# Altium schematic sheet Vector_Mini_ST_2.SchDoc
size 355 x 193 mm; SheetNumber: 2; SheetTotal: 2
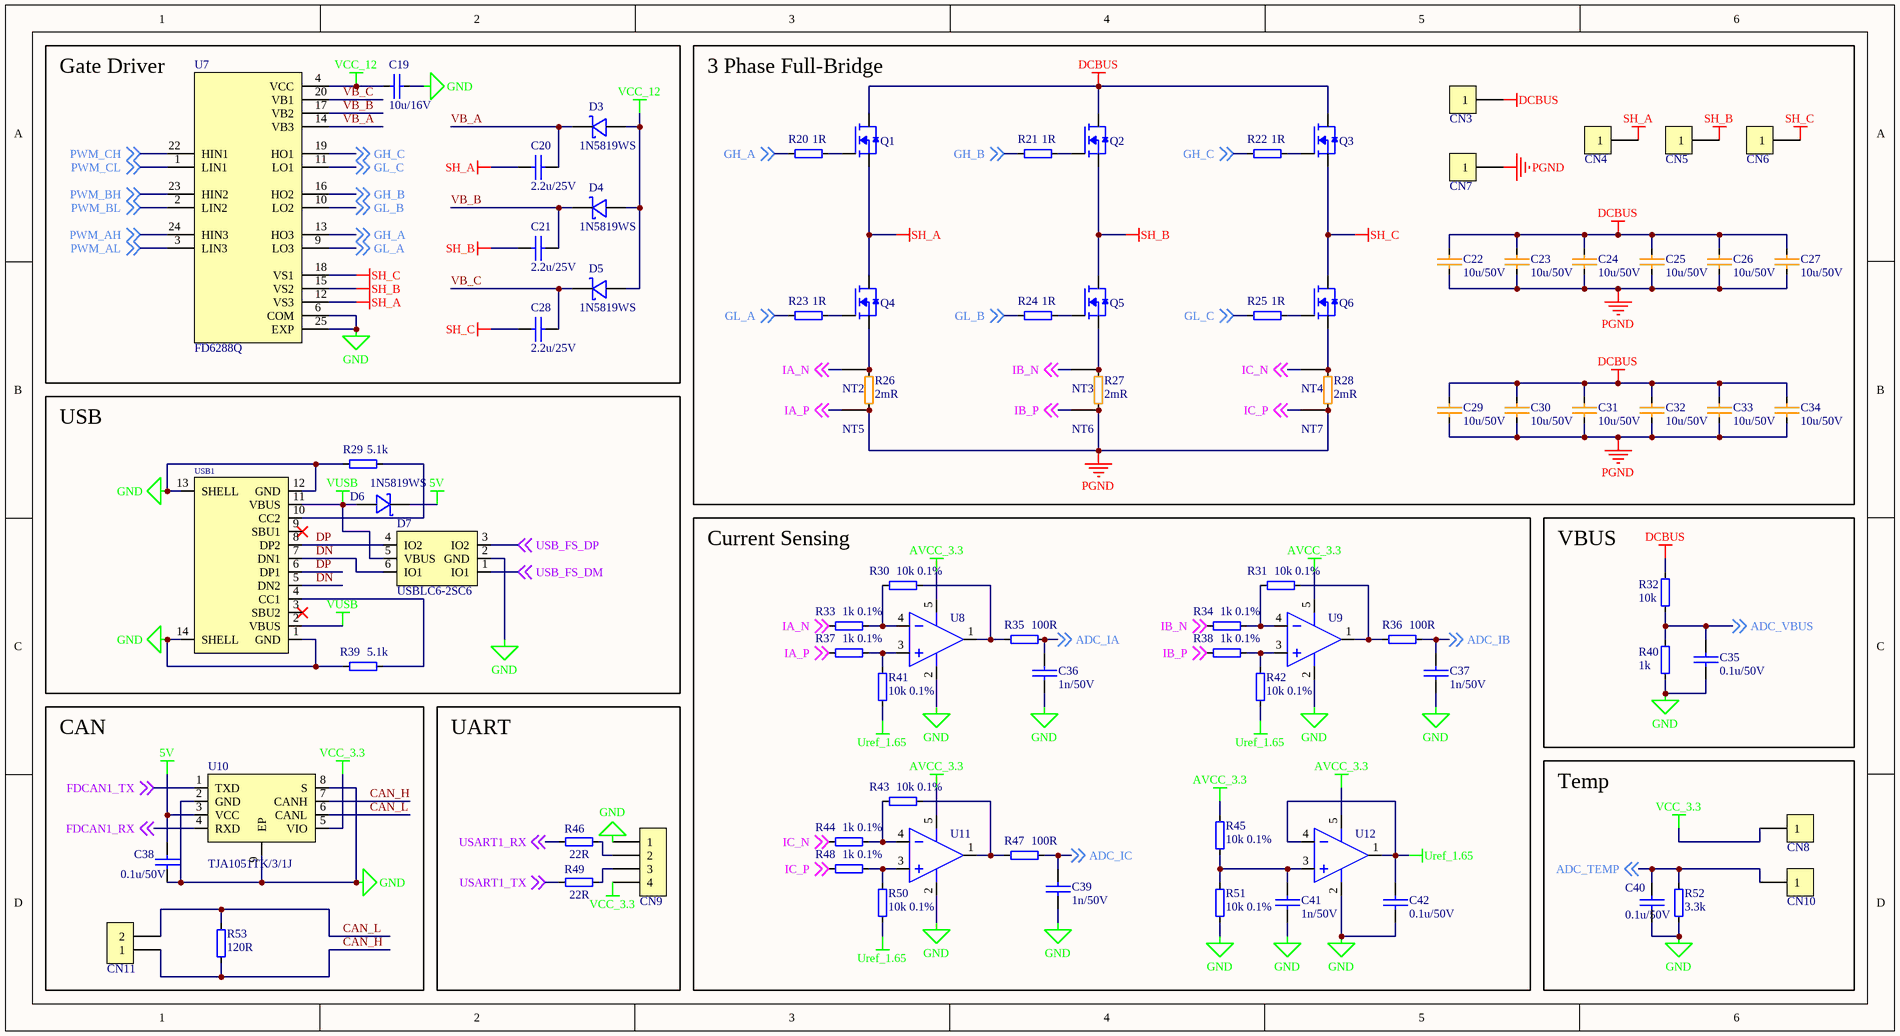
[diagram p0: Vector_Mini_ST_2.SchDoc]

## Parts
C19  10u/16V  [C0603_S]
C20  2.2u/25V  [C0603_S]
C21  2.2u/25V  [C0603_S]
C22  10u/50V  [C1206_S]
C23  10u/50V  [C1206_S]
C24  10u/50V  [C1206_S]
C25  10u/50V  [C1206_S]
C26  10u/50V  [C1206_S]
C27  10u/50V  [C1206_S]
C28  2.2u/25V  [C0603_S]
C29  10u/50V  [C1206_S]
C30  10u/50V  [C1206_S]
C31  10u/50V  [C1206_S]
C32  10u/50V  [C1206_S]
C33  10u/50V  [C1206_S]
C34  10u/50V  [C1206_S]
C35  0.1u/50V  [C0603_S]
C36  1n/50V  [C0603_S]
C37  1n/50V  [C0603_S]
C38  0.1u/50V  [C0603_S]
C39  1n/50V  [C0603_S]
C40  0.1u/50V  [C0603_S]
C41  1n/50V  [C0603_S]
C42  0.1u/50V  [C0603_S]
CN3  PAD 5*4  [PAD 5*4]  (value not drawn)
CN4  PAD 5*4  [PAD 5*4]  (value not drawn)
CN5  PAD 5*4  [PAD 5*4]  (value not drawn)
CN6  PAD 5*4  [PAD 5*4]  (value not drawn)
CN7  PAD 5*4  [PAD 5*4]  (value not drawn)
CN8  PAD 1*1  [PAD 1*1]  (value not drawn)
CN9  GH1.25-4P  [GH1.25-WS-4P]  (value not drawn)
CN10  PAD 1*1  [PAD 1*1]  (value not drawn)
CN11  GH1.25-2P  [GH1.25-WS-2P]  (value not drawn)
D3  1N5819WS  [SOD-323]
D4  1N5819WS  [SOD-323]
D5  1N5819WS  [SOD-323]
D6  1N5819WS  [SOD-323]
D7  USBLC6-2SC6  [SOT-23-6]
NT2  NetTie_6mil  [Nettie6mil]  (value not drawn)  (net tie, no BOM)
NT3  NetTie_6mil  [Nettie6mil]  (value not drawn)  (net tie, no BOM)
NT4  NetTie_6mil  [Nettie6mil]  (value not drawn)  (net tie, no BOM)
NT5  NetTie_6mil  [Nettie6mil]  (value not drawn)  (net tie, no BOM)
NT6  NetTie_6mil  [Nettie6mil]  (value not drawn)  (net tie, no BOM)
NT7  NetTie_6mil  [Nettie6mil]  (value not drawn)  (net tie, no BOM)
Q1  CSD18540Q5B  [VSON-8]  (value not drawn)
Q2  CSD18540Q5B  [VSON-8]  (value not drawn)
Q3  CSD18540Q5B  [VSON-8]  (value not drawn)
Q4  CSD18540Q5B  [VSON-8]  (value not drawn)
Q5  CSD18540Q5B  [VSON-8]  (value not drawn)
Q6  CSD18540Q5B  [VSON-8]  (value not drawn)
R20  1R  [R0603_S]
R21  1R  [R0603_S]
R22  1R  [R0603_S]
R23  1R  [R0603_S]
R24  1R  [R0603_S]
R25  1R  [R0603_S]
R26  2mR  [R2512_S]
R27  2mR  [R2512_S]
R28  2mR  [R2512_S]
R29  5.1k  [R0603_S]
R30  10k 0.1%  [R0603_S]
R31  10k 0.1%  [R0603_S]
R32  10k  [R0603_S]
R33  1k 0.1%  [R0603_S]
R34  1k 0.1%  [R0603_S]
R35  100R  [R0603_S]
R36  100R  [R0603_S]
R37  1k 0.1%  [R0603_S]
R38  1k 0.1%  [R0603_S]
R39  5.1k  [R0603_S]
R40  1k  [R0603_S]
R41  10k 0.1%  [R0603_S]
R42  10k 0.1%  [R0603_S]
R43  10k 0.1%  [R0603_S]
R44  1k 0.1%  [R0603_S]
R45  10k 0.1%  [R0603_S]
R46  22R  [R0603_S]
R47  100R  [R0603_S]
R48  1k 0.1%  [R0603_S]
R49  22R  [R0603_S]
R50  10k 0.1%  [R0603_S]
R51  10k 0.1%  [R0603_S]
R52  3.3k  [R0603_S]
R53  120R  [R0603_S]
U7  FD6288Q  [QFN-24]
U8  RS721XF  [SOT-23-5]  (value not drawn)
U9  RS721XF  [SOT-23-5]  (value not drawn)
U10  TJA1051TK/3/1J  [VDFN-8]
U11  RS721XF  [SOT-23-5]  (value not drawn)
U12  RS721XF  [SOT-23-5]  (value not drawn)
USB1  TYPEC-WS-16P  [TYPEC-WS-16P]  (value not drawn)

## Blocks framed on the sheet
Gate Driver: C19-C21 C28 D3-D5 U7
3 Phase Full-Bridge: C22-C27 C29-C34 CN3-CN7 NT2-NT7 Q1-Q6 R20-R28
USB: D6 D7 R29 R39 USB1
Current Sensing: C36 C37 C39 C41 C42 R30 R31 R33-R38 R41-R45 R47 R48 R50 R51 U8 U9 U11 U12
VBUS: C35 R32 R40
CAN: C38 CN11 R53 U10
UART: CN9 R46 R49
Temp: C40 CN8 CN10 R52

## Nets
5V: C38.1 D6.1(K) U10.3(VCC)
AVCC_3.3: R45.2 U8.5(V+) U9.5(V+) U11.5(V+) U12.5(V+)
DCBUS: C22.1 C23.1 C24.1 C25.1 C26.1 C27.1 C29.1 C30.1 C31.1 C32.1 C33.1 C34.1 CN3.1 Q1.3(D) Q2.3(D) Q3.3(D) R32.2
GND: C19.2 C35.1 C36.1 C37.1 C38.2 C39.1 C40.2 C41.1 C42.1 CN9.1 D7.2(GND) R29.1 R39.1 R40.1 R51.1 R52.1 U7.6(COM) U7.25(EXP) U8.2(V-) U9.2(V-) U10.2(GND) U10.8(S) U10.9(EP) U11.2(V-) U12.2(V-) USB1.1(GND) USB1.12(GND) USB1.13(SHELL) USB1.14(SHELL)
PGND: C22.2 C23.2 C24.2 C25.2 C26.2 C27.2 C29.2 C30.2 C31.2 C32.2 C33.2 C34.2 CN7.1 NT5.2 NT6.2 NT7.2 R26.1 R27.1 R28.1
SH_A: C20.1 CN4.1 Q1.1(S) Q4.3(D) U7.12(VS3)
SH_B: C21.1 CN5.1 Q2.1(S) Q5.3(D) U7.15(VS2)
SH_C: C28.1 CN6.1 Q3.1(S) Q6.3(D) U7.18(VS1)
Uref_1.65: C42.2 R41.1 R42.1 R50.1 U12.1(OUT) U12.4(-IN)
VCC_3.3: CN8.1 CN9.4 U10.5(VIO)
VCC_12: C19.1 D3.2(A) D4.2(A) D5.2(A) U7.4(VCC)
VUSB: D6.2(A) D7.5(VBUS) USB1.2(VBUS) USB1.11(VBUS)
ADC_IA: C36.2 R35.2 ; off-sheet ADC_IA
ADC_IB: C37.2 R36.2 ; off-sheet ADC_IB
ADC_IC: C39.2 R47.2 ; off-sheet ADC_IC
ADC_TEMP: C40.1 CN10.1 R52.2 ; off-sheet ADC_TEMP
ADC_VBUS: C35.2 R32.1 R40.2 ; off-sheet ADC_VBUS
CAN_H: CN11.1 R53.1 U10.7(CANH)
CAN_L: CN11.2 R53.2 U10.6(CANL)
DN: D7.6(IO1) USB1.5(DN2) USB1.7(DN1)
DP: D7.4(IO2) USB1.6(DP1) USB1.8(DP2)
FDCAN1_RX: U10.4(RXD) ; off-sheet FDCAN1_RX
FDCAN1_TX: U10.1(TXD) ; off-sheet FDCAN1_TX
GH_A: R20.1 U7.13(HO3) ; off-sheet GH_A
GH_B: R21.1 U7.16(HO2) ; off-sheet GH_B
GH_C: R22.1 U7.19(HO1) ; off-sheet GH_C
GL_A: R23.1 U7.9(LO3) ; off-sheet GL_A
GL_B: R24.1 U7.10(LO2) ; off-sheet GL_B
GL_C: R25.1 U7.11(LO1) ; off-sheet GL_C
IA_N: NT2.1 R33.1 ; off-sheet IA_N
IA_P: NT5.1 R37.1 ; off-sheet IA_P
IB_N: NT3.1 R34.1 ; off-sheet IB_N
IB_P: NT6.1 R38.1 ; off-sheet IB_P
IC_N: NT4.1 R44.1 ; off-sheet IC_N
IC_P: NT7.1 R48.1 ; off-sheet IC_P
PWM_AH: U7.24(HIN3) ; off-sheet PWM_AH
PWM_AL: U7.3(LIN3) ; off-sheet PWM_AL
PWM_BH: U7.23(HIN2) ; off-sheet PWM_BH
PWM_BL: U7.2(LIN2) ; off-sheet PWM_BL
PWM_CH: U7.22(HIN1) ; off-sheet PWM_CH
PWM_CL: U7.1(LIN1) ; off-sheet PWM_CL
USART1_RX: R46.1 ; off-sheet USART1_RX
USART1_TX: R49.1 ; off-sheet USART1_TX
USB_FS_DM: D7.1(IO1) ; off-sheet USB_FS_DM
USB_FS_DP: D7.3(IO2) ; off-sheet USB_FS_DP
VB_A: C20.2 D3.1(K) U7.14(VB3)
VB_B: C21.2 D4.1(K) U7.17(VB2)
VB_C: C28.2 D5.1(K) U7.20(VB1)
NetC41_2: C41.2 R45.1 R51.2 U12.3(+IN)
NetCN9_2: CN9.2 R46.2
NetCN9_3: CN9.3 R49.2
NetNT2_2: NT2.2 Q4.1(S) R26.2
NetNT3_2: NT3.2 Q5.1(S) R27.2
NetNT4_2: NT4.2 Q6.1(S) R28.2
NetQ1_2: Q1.2(G) R20.2
NetQ2_2: Q2.2(G) R21.2
NetQ3_2: Q3.2(G) R22.2
NetQ4_2: Q4.2(G) R23.2
NetQ5_2: Q5.2(G) R24.2
NetQ6_2: Q6.2(G) R25.2
NetR29_2: R29.2 USB1.10(CC2)
NetR30_1: R30.1 R33.2 U8.4(-IN)
NetR30_2: R30.2 R35.1 U8.1(OUT)
NetR31_1: R31.1 R34.2 U9.4(-IN)
NetR31_2: R31.2 R36.1 U9.1(OUT)
NetR37_2: R37.2 R41.2 U8.3(+IN)
NetR38_2: R38.2 R42.2 U9.3(+IN)
NetR39_2: R39.2 USB1.4(CC1)
NetR43_1: R43.1 R44.2 U11.4(-IN)
NetR43_2: R43.2 R47.1 U11.1(OUT)
NetR48_2: R48.2 R50.2 U11.3(+IN)

Not connected (* = marked no-connect by the designer): USB1 3(SBU2)* 9(SBU1)*

## Library data of the parts
C19-C21 C28 C35-C42 = CAP: 贴片电容
C22-C27 C29-C34 = C1206: 1206贴片电容
D3-D6 = 1N5819WS: 肖特基二极管; Manufacturer: Hottech(合科泰); Device: 1N5819WS_C191023; Add into BOM: yes; Forward Voltage (Vf@If): 600mV@1A; Reverse Voltage (Vr): 40V; Average Rectified Current (Io): 1A; Symbol: 1N5819WS; Supplier: LCSC; Supplier Part: C191023; Manufacturer Part: 1N5819WS; JLCPCB Part Class: 基础库; LCSC Part Name: 电压:40V 电流:1A; Supplier Footprint: SOD-323; Datasheet: https://atta.szlcsc.com/upload/public/pdf/source/20220428/3CB86FD8D28D653594B4E35F9D5AEFD9.pdf; Convert to PCB: yes
D7 = USBLC6-2SC6: USB 2.0高速接口的ESD保护
Q1-Q6 = CSD18540Q5B: MF: Texas Instruments; SnapEDA_Link: https://www.snapeda.com/parts/CSD18540Q5B/Texas+Instruments/view-part/?ref=snap; Package: VSON-CLIP-8 Texas Instruments; Value: *; MP: CSD18540Q5B; Check_prices: https://www.snapeda.com/parts/CSD18540Q5B/Texas+Instruments/view-part/?ref=eda
R20-R25 R29-R53 = RES: 贴片电阻
R26-R28 = R2512: 2512贴片电阻
U7 = FD6288Q: 三相栅极驱动; MF: {'manufacturer': u'Fortior Tech'}; Package: None; Price: None; Value: *; MP: FD6288Q; Availability: Unavailable
U10 = TJA1051TK/3/1J: Manufacturer: NXP(恩智浦); Symbol: TJA1051T/1J; Add into BOM: yes; Data Rate: 5Mbps; Supply Voltage: 4.5V~5.5V; Device: TJA1051T/1J; LCSC Part Name: 5Mbps 4.5V~5.5V; Supplier Part: C92211; Manufacturer Part: TJA1051T/1J; Supplier Footprint: SOIC-8; JLCPCB Part Class: 扩展库; Datasheet: https://atta.szlcsc.com/upload/public/pdf/source/20170810/C124020_1502335225901879762.pdf; Supplier: LCSC; Convert to PCB: yes; Type: 收发器; Operating Temperature: -40℃~+150℃
USB1 = TYPEC-WS-16P: Manufacturer: SHOU HAN(首韩); Symbol: TYPE-C 16PIN 2MD(073); Add into BOM: yes; Connector Type: Type-C; Gender: 母座; Number of Contacts: 16; Number of Ports: 1; Current Rating - Power (Max): 5A; Device: TYPE-C 16PIN 2MD(073); LCSC Part Name: TYPE-C母座 16P 4脚插件带定位柱 不锈钢外壳 2次模顶; Supplier Part: C2765186; Manufacturer Part: TYPE-C 16PIN 2MD(073); Supplier Footprint: SMD; JLCPCB Part Class: 扩展库; Supplier: LCSC; Convert to PCB: yes; Standard: -; Mounting Style: 卧贴; Operating Temperature Range: -25℃~+85℃